# Altium project Carrier_Board_Template.PrjPcb (part 2 of 2)

## Sheet leds.SchDoc: Title
size B; Organization: Midnight Sun Solar Rayce Car Team; Address1: University of Waterloo; Address2: 200 University Ave W; Address3: Waterloo, ON, Canada; Address4: N2L 3E9; Website: www.uwmidsun.com; ProjectName: ProjectName
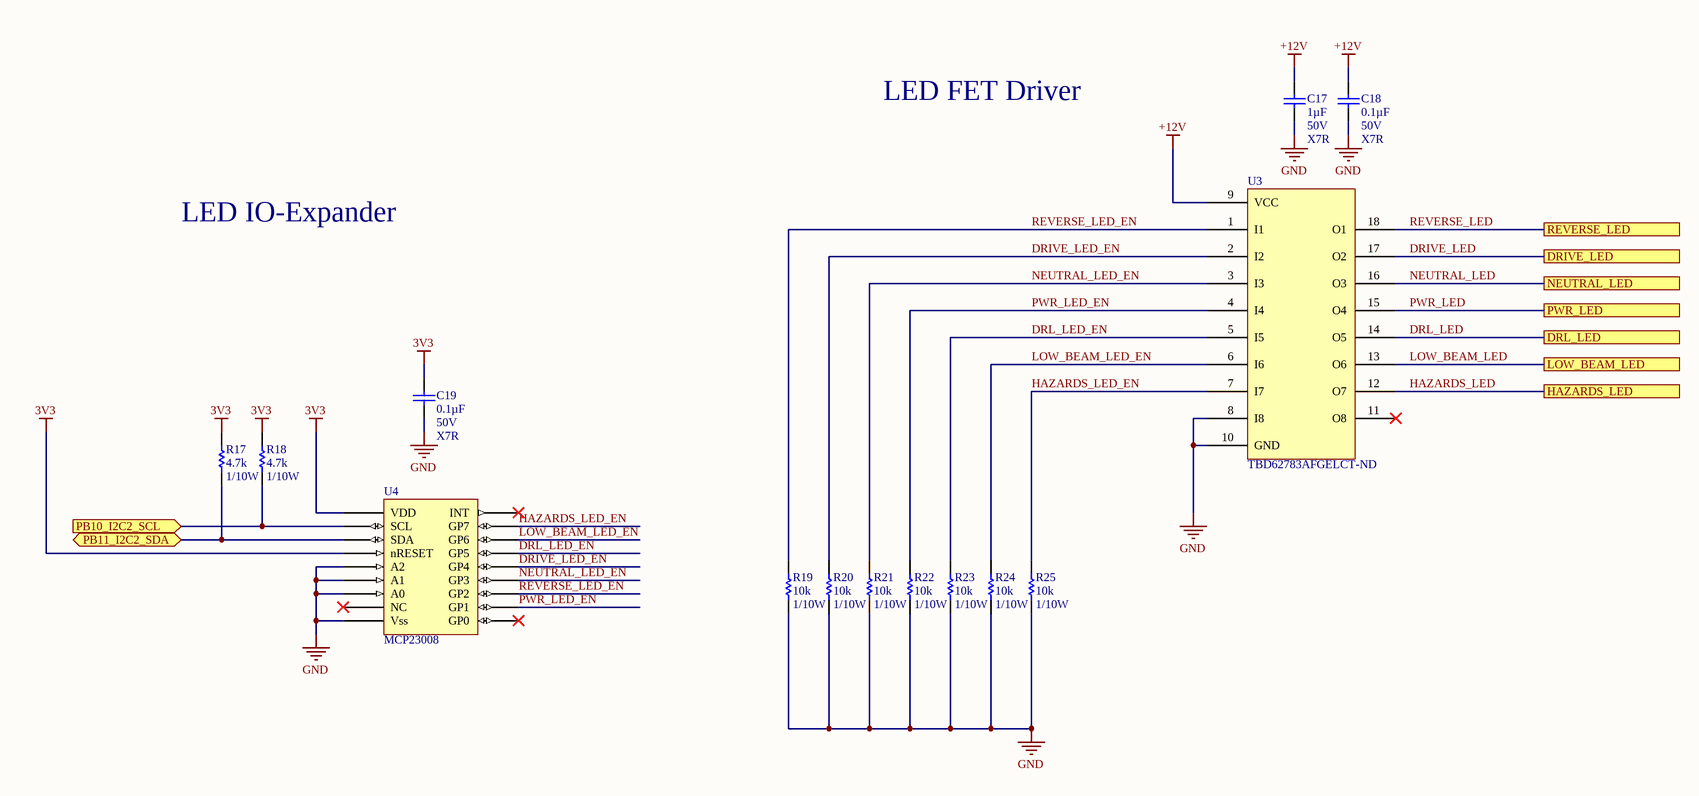
[diagram p3: leds.SchDoc]

### Parts
C17  Capacitance: 1µF  Voltage: 50V  Temperature Coefficient: X7R  [CAP, 0603]  (hidden comment: CAP CER 1UF 50V 10% X7R 0603)
C18  Capacitance: 0.1µF  Voltage: 50V  Temperature Coefficient: X7R  [CAP, 0603]  (hidden comment: CAP CER 0.1UF 50V 10% X7R 0603)
C19  Capacitance: 0.1µF  Voltage: 50V  Temperature Coefficient: X7R  [CAP, 0603]  (hidden comment: CAP CER 0.1UF 50V 10% X7R 0603)
R17  Resistance (Ohms): 4.7k  Power (Watts): 1/10W  [RES, 0603]  (hidden comment: RES 4.7K OHM 1% 1/10W 0603)
R18  Resistance (Ohms): 4.7k  Power (Watts): 1/10W  [RES, 0603]  (hidden comment: RES 4.7K OHM 1% 1/10W 0603)
R19  Resistance: 10k  Power: 1/10W  [RES, 0603]  (hidden comment: RES 10K OHM 1% 1/10W 0603)
R20  Resistance: 10k  Power: 1/10W  [RES, 0603]  (hidden comment: RES 10K OHM 1% 1/10W 0603)
R21  Resistance: 10k  Power: 1/10W  [RES, 0603]  (hidden comment: RES 10K OHM 1% 1/10W 0603)
R22  Resistance: 10k  Power: 1/10W  [RES, 0603]  (hidden comment: RES 10K OHM 1% 1/10W 0603)
R23  Resistance: 10k  Power: 1/10W  [RES, 0603]  (hidden comment: RES 10K OHM 1% 1/10W 0603)
R24  Resistance: 10k  Power: 1/10W  [RES, 0603]  (hidden comment: RES 10K OHM 1% 1/10W 0603)
R25  Resistance: 10k  Power: 1/10W  [RES, 0603]  (hidden comment: RES 10K OHM 1% 1/10W 0603)
U3  Supplier Part Number 1: TBD62783AFGELCT-ND  [IC LOAD SWITCH 8CH 0.5A 18-SSOP]  (hidden comment: IC LOAD SWITCH 8CH 0.5A 18SOP)
U4  MCP23008  [IC 18SOIC]

### Ports
DRIVE_LED, DRL_LED, HAZARDS_LED, LOW_BEAM_LED, NEUTRAL_LED, PB10_I2C2_SCL (in), PB11_I2C2_SDA (bidir), PWR_LED, REVERSE_LED

### Nets
3V3: C19.1 R17.1 R18.1 U4.6(nRESET) U4.18(VDD)
+12V: C17.1 C18.1 U3.9(VCC)
GND: C17.2 C18.2 C19.2 R19.2 R20.2 R21.2 R22.2 R23.2 R24.2 R25.2 U3.8(I8) U3.10(GND) U4.3(A2) U4.4(A1) U4.5(A0) U4.9(Vss)
DRIVE_LED: U3.17(O2) ; port DRIVE_LED
DRIVE_LED_EN: R20.1 U3.2(I2) U4.14(GP4)
DRL_LED: U3.14(O5) ; port DRL_LED
DRL_LED_EN: R23.1 U3.5(I5) U4.15(GP5)
HAZARDS_LED: U3.12(O7) ; port HAZARDS_LED
HAZARDS_LED_EN: R25.1 U3.7(I7) U4.17(GP7)
LOW_BEAM_LED: U3.13(O6) ; port LOW_BEAM_LED
LOW_BEAM_LED_EN: R24.1 U3.6(I6) U4.16(GP6)
NEUTRAL_LED: U3.16(O3) ; port NEUTRAL_LED
NEUTRAL_LED_EN: R21.1 U3.3(I3) U4.13(GP3)
PB10_I2C2_SCL: R18.2 U4.1(SCL) ; port PB10_I2C2_SCL
PB11_I2C2_SDA: R17.2 U4.2(SDA) ; port PB11_I2C2_SDA
PWR_LED: U3.15(O4) ; port PWR_LED
PWR_LED_EN: R22.1 U3.4(I4) U4.11(GP1)
REVERSE_LED: U3.18(O1) ; port REVERSE_LED
REVERSE_LED_EN: R19.1 U3.1(I1) U4.12(GP2)

Not connected (* = marked no-connect by the designer): U3 11(O8)*; U4 7(NC)* 8(INT)* 10(GP0)*

### Notes on the sheet
- LED FET Driver
- LED IO-Expander
- PROJECT
- DOCUMENT
- DRAWN BY
- LAST MODIFIED
- PART NUMBER
- REVISION
- SHEET
- VARIANT
- OF
- Engineering 5 - 1002
  University of Waterloo
  (519) 888-4567 x32978
  hardware@uwmidsun.com

### Library data of the parts
C17 = CAP CER 1UF 50V 10% X7R 0603: 1µF ±10% 50V Ceramic Capacitor X7R 0603 (1608 Metric); Manufacturer 1: Taiyo Yuden; Manufacturer Part Number 1: UMK107AB7105KA-T; Supplier 1: Digi-Key; Supplier Part Number 1: 587-3247-1-ND; Packaging: Cut Tape (CT); Part Status: Active; Operating Temperature: -55°C ~ 125°C; Ratings: -; Mounting Type: Surface Mount, MLCC; Package / Case: 0603 (1608 Metric); Size / Dimension: 0.063" L x 0.031" W (1.60mm x 0.80mm); Height - Seated (Max): -; Thickness (Max): 0.037" (0.95mm); Lead Spacing: -; Lead Style: -; ComponentLink1URL: http://www.yuden.co.jp/productdata/catalog/en/mlcc_all_e.pdf; ComponentLink1Description: http://www.yuden.co.jp/productdata/catalog/en/mlcc_all_e.pdf; Tolerance: ±10%
C18 C19 = CAP CER 0.1UF 50V 10% X7R 0603: 0.10µF ±10% 50V Ceramic Capacitor X7R 0603 (1608 Metric); Manufacturer 1: AVX Corporation; Manufacturer Part Number 1: 06035C104KAT2A; Supplier 1: Digi-Key; Supplier Part Number 1: 478-5052-1-ND; Packaging: Cut Tape (CT); Part Status: Active; Operating Temperature: -55°C ~ 125°C; Ratings: -; Mounting Type: Surface Mount, MLCC; Package / Case: 0603 (1608 Metric); Size / Dimension: 0.063" L x 0.032" W (1.60mm x 0.81mm); Height - Seated (Max): -; Thickness (Max): 0.035" (0.90mm); Lead Spacing: -; Lead Style: -; ComponentLink1URL: http://datasheets.avx.com/X7RDielectric.pdf; ComponentLink1Description: http://datasheets.avx.com/X7RDielectric.pdf; Tolerance: ±10%
R17 R18 = RES 4.7K OHM 1% 1/10W 0603: 4.7k Ohm ±1% 0.1W, 1/10W Chip Resistor 0603 (1608 Metric) Moisture Resistant Thick Film; Manufacturer 1: Yageo; Manufacturer Part Number 1: RC0603FR-074K7L; Description 1: RES SMD 4.7K OHM 1% 1/10W 0603; Temperature Coefficient: ±100ppm/°C; Supplier 1: Digi-Key; Supplier Part Number 1: 311-4.70KHRCT-ND; RoHS: RoHS Compliant; Category: Resistors; Stock 1: 3487566; Pricing 1: 1=0.16, 10=0.022, 100=0.0089, 1000=0.00402, 2500=0.00349 (CAD); Packaging: Cut Tape (CT); Part Status: Active; Composition: Thick Film; Features: Moisture Resistant; Operating Temperature: -55°C ~ 155°C; Package / Case: 0603 (1608 Metric); Supplier Device Package: 0603; Size / Dimension: 0.063" L x 0.031" W (1.60mm x 0.80mm); Height - Seated (Max): 0.022" (0.55mm); Failure Rate: -; ComponentLink1URL: http://www.yageo.com/documents/recent/PYu-RC_Group_51_RoHS_L_7.pdf; ComponentLink1Description: http://www.yageo.com/documents/recent/PYu-RC_Group_51_RoHS_L_7.pdf; Tolerance: ±1%
R19-R25 = RES 10K OHM 1% 1/10W 0603: RES SMD 10K OHM 1% 1/10W 0603; Manufacturer 1: Yageo; Manufacturer Part Number 1: RC0603FR-0710KL; Temperature Coefficient: ±100ppm/°C; Supplier 1: Digi-Key; Supplier Part Number 1: 311-10.0KHRCT-ND; Packaging: Cut Tape (CT); Part Status: Active; Composition: Thick Film; Operating Temperature: -55°C ~ 155°C; Package / Case: 0603 (1608 Metric); Supplier Device Package: 0603; Size / Dimension: 0.063" L x 0.031" W (1.60mm x 0.80mm); Height - Seated (Max): 0.022" (0.55mm); Failure Rate: -; ComponentLink1URL: http://www.yageo.com/documents/recent/PYu-RC_Group_51_RoHS_L_7.pdf; ComponentLink1Description: http://www.yageo.com/documents/recent/PYu-RC_Group_51_RoHS_L_7.pdf; Tolerance: ±1%
U3 = IC LOAD SWITCH 8CH 0.5A 18SOP: IC LOAD SWITCH 8CHANNEL 0.5A 18SOP; Manufacturer: Toshiba; Manufacturer Part Number: TBD62783AFG,EL; Number of Outputs: 8; Interface: On/Off; Max Output Current: 500mA; Output Configuration: High Side; Supplier 1: Digi-Key; RoHS: Yes; Stock 1: 8776; Pricing 1: 1 = 1.15000, 10 = 1.02200, 25 = 0.92280, 100 = 0.80750, 250 = 0.70864, 500 = 0.62624 (USD); Case/Package: SOIC; Number of Pins: 18; Min Operating Temperature: -40°C; Max Operating Temperature: 85°C; Packaging: Cut Tape
U4 = IC I/O EXPANDER I2C 8B 18SOIC: MCP23008 I/O Expander 8B+1Int 18P SOIC; Manufacturer: Microchip Technology; Manufacturer Part Number: MCP23008T-E/SO; Number of I/O: 8; Interface: I²C; Interrupt Output: Yes; Output Type: Push-Pull; Current - Output Source/Sink: 25mA; Voltage - Supply: 1.8 V ~ 5.5 V; Supplier 1: Digi-Key; Supplier Part Number 1: MCP23008T-E/SOCT-ND; RoHS: RoHS Compliant; Category: Integrated Circuits (ICs); Stock 1: 5607; Pricing 1: 1=1.62, 25=1.3548, 100=1.2431 (CAD); Packaging: Cut Tape (CT); Part Status: Active; Features: POR; Operating Temperature: -40°C ~ 125°C; Mounting Type: Surface Mount; Package / Case: 18-SOIC (0.295", 7.50mm Width); Supplier Device Package: 18-SOIC; ComponentLink1URL: http://www.microchip.com/mymicrochip/filehandler.aspx?ddocname=en021920; ComponentLink1Description: http://www.microchip.com/mymicrochip/filehandler.aspx?ddocname=en021920

## Nets that join several sheets
3V3: rPi (R31.1), buttons (C1.1 C4.1 U1.14 U2.5), connectors (7 pins), leds (5 pins)
+5V: rPi (7 pins), connectors (R2.1 TP3.TP)
+12V: rPi (C29.1 R26.1), connectors (8 pins), leds (C17.1 C18.1 U3.9)
GND: rPi (23 pins), buttons (25 pins), connectors (27 pins), leds (16 pins)
DRIVE_BTN: buttons (C15.1 R16.1), connectors (P3.13)
DRIVE_LED: connectors (P3.15), leds (U3.17)
DRL_BTN: buttons (C13.1 R15.1), connectors (P2.11)
DRL_LED: connectors (P2.5), leds (U3.14)
FAN_GND: rPi (Q1.3), connectors (P1.2)
HAZARDS_BTN: buttons (C7.1 R11.1), connectors (P2.1)
HAZARDS_LED: connectors (P2.3), leds (U3.12)
LOW_BEAM_BTN: buttons (C9.1 R12.1), connectors (P2.7)
LOW_BEAM_LED: connectors (P2.9), leds (U3.13)
NEUTRAL_BTN: buttons (C11.1 R13.1), connectors (P3.9)
NEUTRAL_LED: connectors (P3.11), leds (U3.16)
PA0_LOW_BEAM: buttons (R9.1 U1.2), connectors (P5.25)
PA1_HAZARDS: buttons (R8.1 U1.4), connectors (P5.24)
PA2_RPI_USART2_TX: rPi (P6.10), connectors (P5.23)
PA3_RPI_USART2_RX: rPi (P6.8), connectors (P5.22)
PA4_DRL: buttons (R7.1 U1.6), connectors (P5.21)
PA5_DRIVE: buttons (R6.1 U1.8), connectors (P5.20)
PA6_NEUTRAL: buttons (R5.1 U1.10), connectors (P5.19)
PA7_REVERSE: buttons (R4.1 U1.12), connectors (P5.18)
PB0_POWER: buttons (R14.1 U2.4), connectors (P5.17)
PB1/5V_MONITOR: rPi (R28.2 R30.1), connectors (P5.16)
PB9_FAN_EN: rPi (R32.1), connectors (P5.31)
PB10_I2C2_SCL: connectors (P5.14 TP5.TP), leds (R18.2 U4.1)
PB11_I2C2_SDA: connectors (P5.13 TP4.TP), leds (R17.2 U4.2)
PWR_BTN: buttons (C2.1 R3.1), connectors (P3.1)
PWR_LED: connectors (P3.3), leds (U3.15)
REVERSE_BTN: buttons (C5.1 R10.1), connectors (P3.5)
REVERSE_LED: connectors (P3.7), leds (U3.18)